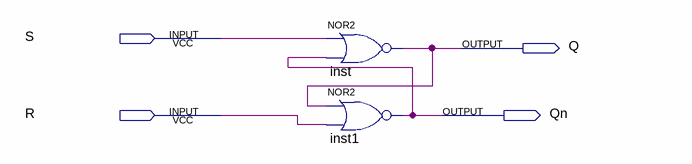
[diagram p0: schematic sheet]
// Quartus schematic project9.bdf as structural Verilog: 2 symbols, 4 pins
module project9 (
  input  S,
  input  R,
  output Q,
  output Qn
);

  nor inst (Q, S, Qn);
  nor inst1 (Qn, Q, R);
endmodule
